# Altium schematic sheet ZZ201P.SchDoc
size A3
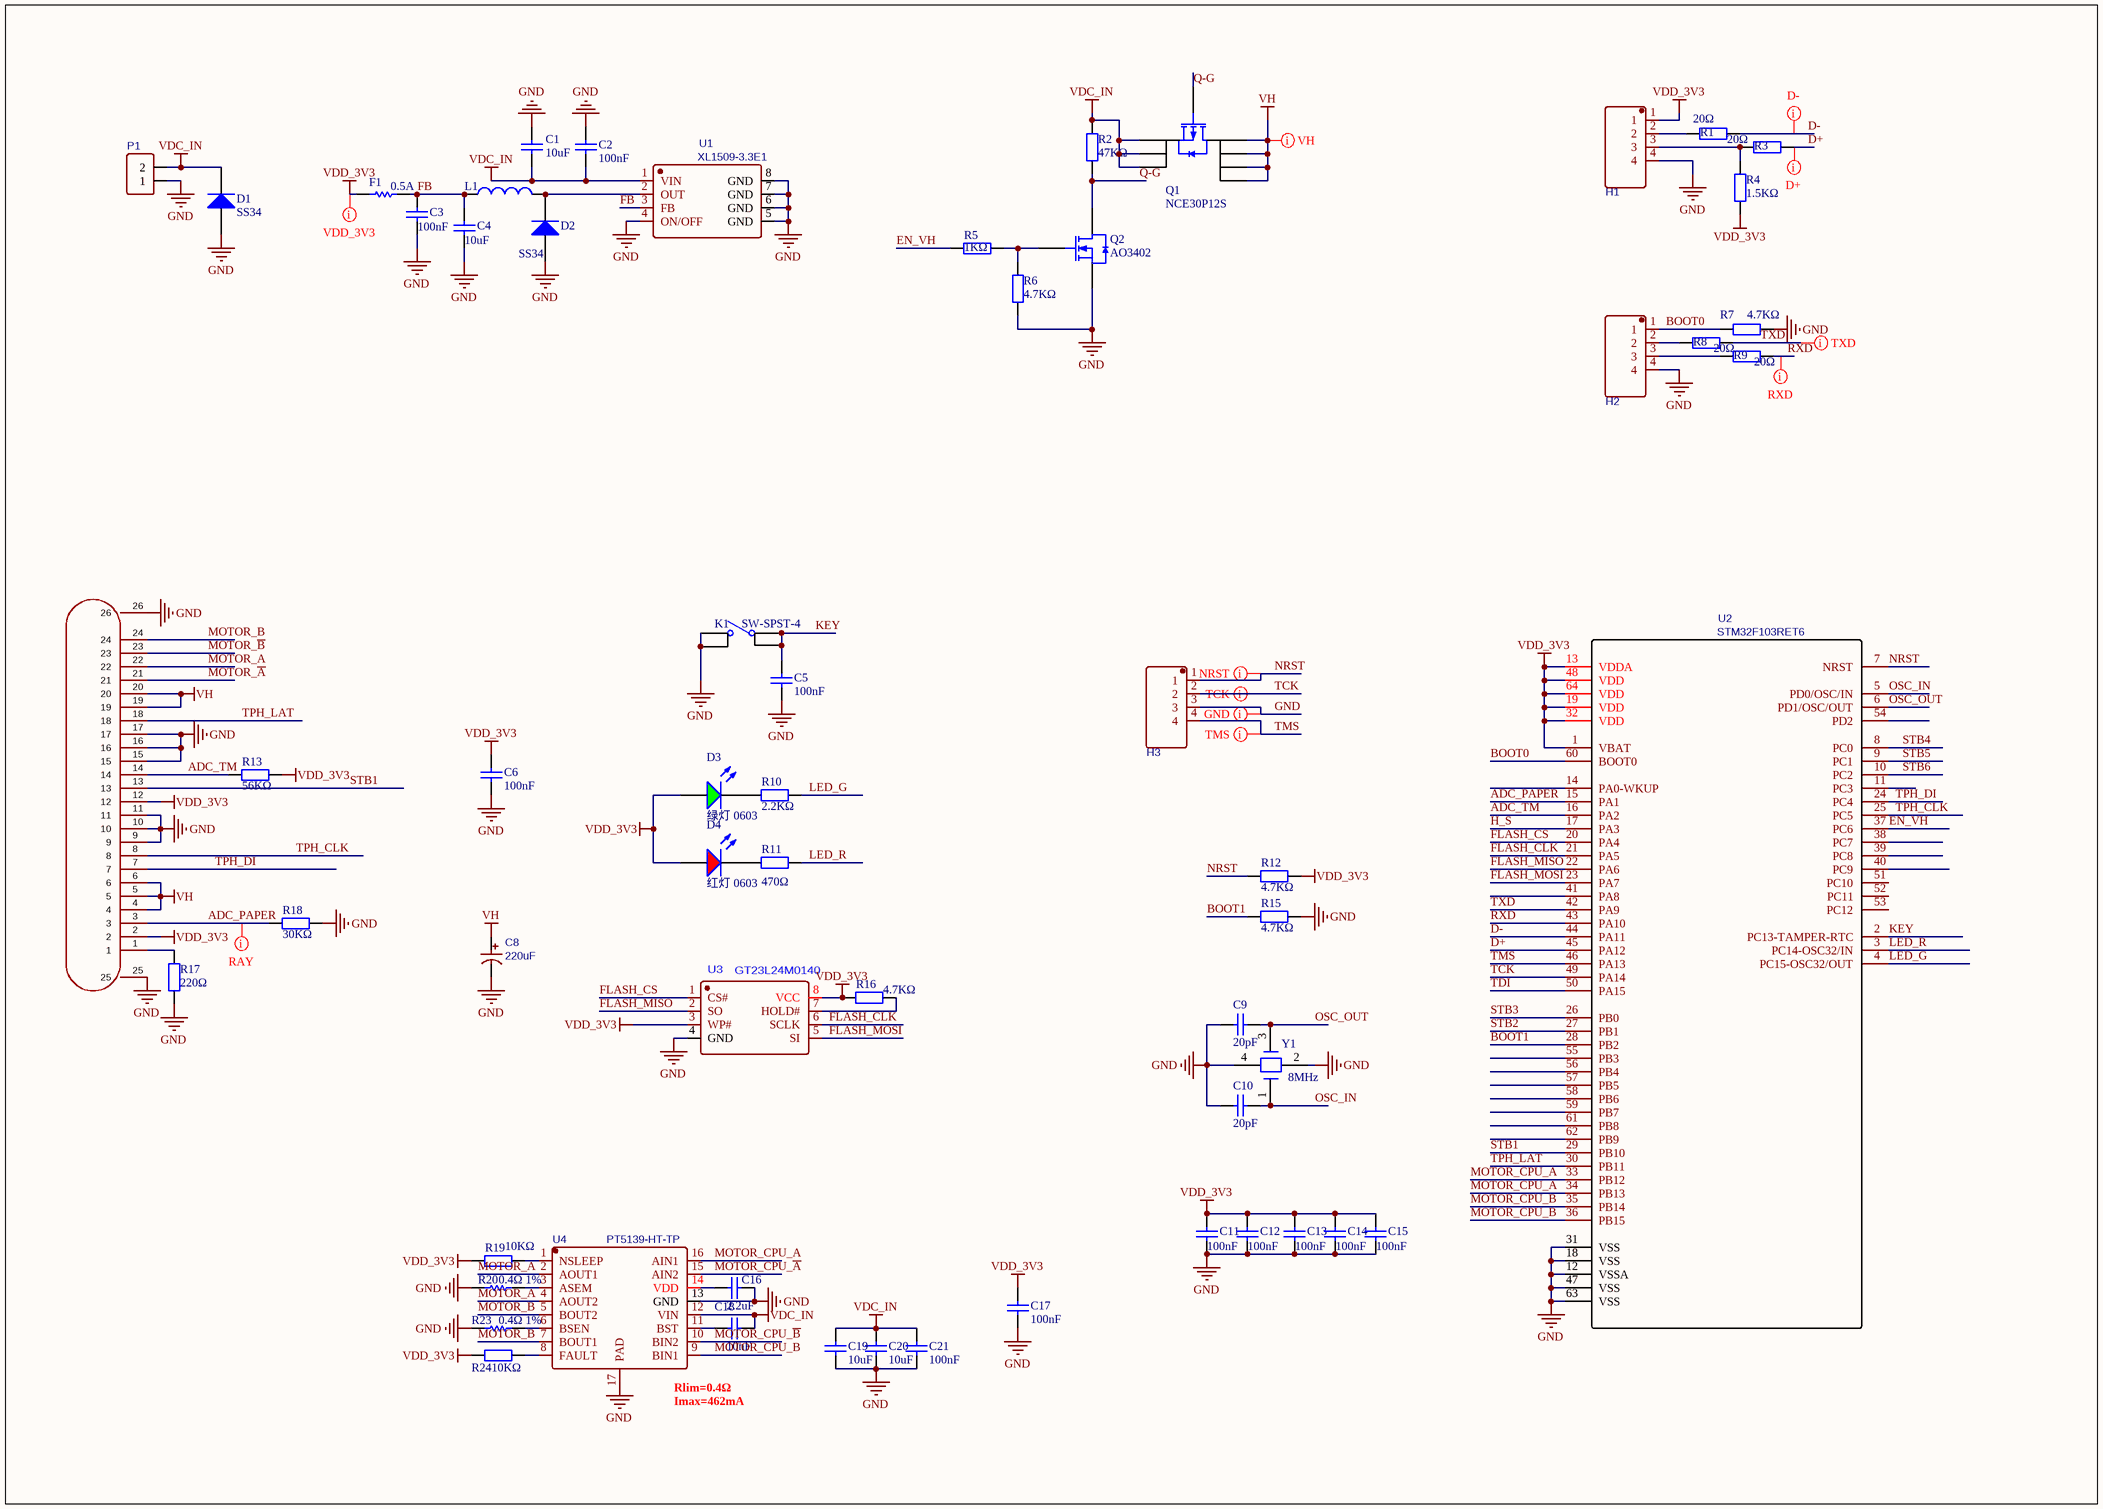
[diagram p0: ZZ201P.SchDoc]

## Parts
C1  10uF  [0603_C]
C2  100nF  [0603_C]
C3  100nF  [0603_C]
C4  10uF  [0603_C]
C5  100nF  [0603_C]
C6  100nF  [0603_C]
C8  220uF  [CASE-B_3528]
C9  20pF  [0603_C]
C10  20pF  [0603_C]
C11  100nF  [0603_C]
C12  100nF  [0603_C]
C13  100nF  [0603_C]
C14  100nF  [0603_C]
C15  100nF  [0603_C]
C16  2.2uF  [0603_C]
C17  100nF  [0603_C]
C18  10nF  [0603_C]
C19  10uF  [0603_C]
C20  10uF  [0603_C]
C21  100nF  [0603_C]
D1  SS34  [SMA_L4.4-W2.8-LS5.4-RD]
D2  SS34  [SMA_L4.4-W2.8-LS5.4-RD]
D3  绿灯 0603  [0603_LED_S1]
D4  红灯 0603  [0603_LED_S1]
F1  0.5A  [0603_R]
FPC?  afc07-s24eca-00  [2P-P2.54-V]  (value not drawn)
H1  77311-462K05LF  [PCBComponent_1 - duplicate]  (value not drawn)
H2  77311-462K05LF  [PCBComponent_1 - duplicate]  (value not drawn)
H3  77311-462K05LF  [5P_1.25]  (value not drawn)
K1  SW-SPST-4  [KEY-SMD_4P-L5.2-W5.2-P3.70-LS6.4]
L1  4040-47uH  [IND-SMD_L4.0-W4.0_FNR40XXS]  (value not drawn)
P1  Header-Female-2.54_1x2  [2P-P2.54-V]  (value not drawn)
Q1  NCE30P12S  [SOIC-8_150mil]
Q2  AO3402  [SOT-23]
R1  20Ω  [0603_R]
R2  47KΩ  [0603_R]
R3  20Ω  [0603_R]
R4  1.5KΩ  [0603_R]
R5  1KΩ  [0603_R]
R6  4.7KΩ  [0603_R]
R7  4.7KΩ  [0603_R]
R8  20Ω  [0603_R]
R9  20Ω  [0603_R]
R10  2.2KΩ  [0603_R]
R11  470Ω  [0603_R]
R12  4.7KΩ  [0603_R]
R13  56KΩ  [0603_R]
R15  4.7KΩ  [0603_R]
R16  4.7KΩ  [0603_R]
R17  220Ω  [0603_C]
R18  30KΩ  [0603_R]
R19  10KΩ  [0603_R]
R20  0.4Ω 1%  [1206_r]
R23  0.4Ω 1%  [1206_R]
R24  10KΩ  [0603_R]
U1  XL1509-3.3E1  [SOP-8_L4.9-W3.9-P1.27-LS6.0-BL]
U2  STM32F103RET6  [LQFP-64_L10.0-W10.0-P0.50-LS12.0-BL]
U3  GT23L24M0140  [SOP-8_L5.3-W5.3-P1.27-LS8.0-BL]
U4  PT5139-HT-TP  [HTSSOP-16_L5.0-W4.4-P0.65-LS6.4-BL-EP]
Y1  8MHz  [XT_3225_4]

## Nets
GND: C1.2 C2.2 C3.2 C4.2 C5.2 C6.1 C8.2 C9.1 C10.1 C11.1 C12.1 C13.1 C14.1 C15.1 C16.2 C17.1 C19.1 C20.1 C21.1 D1.1(A) D2.1(A) FPC?.9 FPC?.10 FPC?.11 FPC?.15 FPC?.16 FPC?.17 FPC?.25 FPC?.26 H1.4 H2.4 H3.3 K1.3 K1.4(NO) P1.1 Q2.2(S) R6.1 R7.2 R15.1 R17.1 R18.2 R20.2 R23.2 U1.4(ON/OFF) U1.5(GND) U1.6(GND) U1.7(GND) U1.8(GND) U2.12(VSSA) U2.18(VSS) U2.31(VSS) U2.47(VSS) U2.63(VSS) U3.4(GND) U4.13(GND) U4.17(PAD) Y1.2 Y1.4
VDC_IN: C1.1 C2.1 C18.2 C19.2 C20.2 C21.2 D1.2(K) P1.2 Q1.1(S) Q1.2(S) Q1.3(S) R2.2 U1.1(VIN) U4.12(VIN)
VDD_3V3: C6.2 C11.2 C12.2 C13.2 C14.2 C15.2 C17.2 D3.A D4.A F1.1 FPC?.2 FPC?.12 H1.1 R4.1 R12.1 R13.2 R16.2 R19.2 R24.2 U2.1(VBAT) U2.13(VDDA) U2.19(VDD) U2.32(VDD) U2.48(VDD) U2.64(VDD) U3.3(WP#) U3.8(VCC)
VH: C8.1 FPC?.4 FPC?.5 FPC?.6 FPC?.19 FPC?.20 Q1.5(D) Q1.6(D) Q1.7(D) Q1.8(D)
ADC_PAPER: FPC?.3 R18.1 U2.15(PA1)
ADC_TM: FPC?.14 R13.1 U2.16(PA2)
BOOT0: H2.1 R7.1 U2.60(BOOT0)
BOOT1: R15.2 U2.28(PB2)
D+: R3.2 U2.45(PA12)
D-: R1.2 U2.44(PA11)
EN_VH: R5.2 U2.37(PC6)
FB: C3.1 C4.1 F1.2 L1.1 U1.3(FB)
FLASH_CLK: U2.21(PA5) U3.6(SCLK)
FLASH_CS: U2.20(PA4) U3.1(CS#)
FLASH_MISO: U2.22(PA6) U3.2(SO)
FLASH_MOSI: U2.23(PA7) U3.5(SI)
H_S: U2.17(PA3)
KEY: C5.1 K1.1(COMMON) K1.2 U2.2(PC13-TAMPER-RTC)
LED_G: R10.2 U2.4(PC15-OSC32/OUT)
LED_R: R11.2 U2.3(PC14-OSC32/IN)
MOTOR_A: FPC?.22 U4.2(AOUT1)
MOTOR_~{A}: FPC?.21 U4.4(AOUT2)
MOTOR_B: FPC?.24 U4.7(BOUT1)
MOTOR_~{B}: FPC?.23 U4.5(BOUT2)
MOTOR_CPU_A: U2.33(PB12) U4.16(AIN1)
MOTOR_CPU_~{A}: U2.34(PB13) U4.15(AIN2)
MOTOR_CPU_B: U2.36(PB15) U4.9(BIN1)
MOTOR_CPU_~{B}: U2.35(PB14) U4.10(BIN2)
NRST: H3.1 R12.2 U2.7(NRST)
OSC_IN: C10.2 U2.5(PD0/OSC/IN) Y1.1(OSC1)
OSC_OUT: C9.2 U2.6(PD1/OSC/OUT) Y1.3(OSC2)
Q-G: Q1.4(G) Q2.3(D) R2.1
RXD: R9.2 U2.43(PA10)
STB1: FPC?.13 U2.29(PB10)
STB2: U2.27(PB1)
STB3: U2.26(PB0)
STB4: U2.8(PC0)
STB5: U2.9(PC1)
STB6: U2.10(PC2)
TCK: H3.2 U2.49(PA14)
TDI: U2.50(PA15)
TMS: H3.4 U2.46(PA13)
TPH_CLK: FPC?.8 U2.25(PC5)
TPH_DI: FPC?.7 U2.24(PC4)
TPH_LAT: FPC?.18 U2.30(PB11)
TXD: R8.2 U2.42(PA9)
NetC16_1: C16.1 U4.14(VDD)
NetC18_1: C18.1 U4.11(BST)
NetD2_2: D2.2(K) L1.2 U1.2(OUT)
NetD3_K: D3.K R10.1
NetD4_K: D4.K R11.1
NetFPC?_1: FPC?.1 R17.2
NetH1_2: H1.2 R1.1
NetH1_3: H1.3 R3.1 R4.2
NetH2_2: H2.2 R8.1
NetH2_3: H2.3 R9.1
NetQ2_1: Q2.1(G) R5.1 R6.2
NetR16_1: R16.1 U3.7(HOLD#)
NetR19_1: R19.1 U4.1(NSLEEP)
NetR20_1: R20.1 U4.3(ASEM)
NetR23_1: R23.1 U4.6(BSEN)
NetR24_1: R24.1 U4.8(FAULT)

Not connected (* = marked no-connect by the designer): U2 11(PC3) 14(PA0-WKUP) 38(PC7) 39(PC8) 40(PC9) 41(PA8) 51(PC10) 52(PC11) 53(PC12) 54(PD2) 55(PB3) 56(PB4) 57(PB5) 58(PB6) 59(PB7) 61(PB8) 62(PB9)

## Layout directives
Column: TestVectorIndex: ADC_PAPER, D+, D-, GND, NRST, RXD, TCK, TMS, TXD, VDD_3V3, VH

## Notes on the sheet
- (near U4) Rlim=0.4Ω
- (near U4) Imax=462mA

## Library data of the parts
C1 C19 C20 = 0805 10uF (106) 10% 25V: 贴片电容; ComponentLink1Description: 供应商链接; ComponentLink1URL: http://www.szlcsc.com/product/details_16532.html; Package: 0805; Supplier: LC; SuppliersPartNumber: C15850
C2-C6 C11-C15 C17 C21 = 0603 100nF (104) 10% 50V: 贴片电容; ComponentLink1Description: 供应商链接; ComponentLink1URL: http://www.szlcsc.com/product/details_15331.html; Package: 0603; Supplier: LC; SuppliersPartNumber: C14663
C8 = 10uF: BOM_Manufacturer: ValuePro; BOM_Manufacturer Part: 10uF 25V RHOS; nameAlias: Capacitance; BOM_Supplier: LCSC; BOM_Supplier Part: C19576; spicePre: C; spiceSymbolName: 10uF 25V RHOS
C9 C10 = 0603 10pF (100) 5% 50V: 贴片电容; ComponentLink1Description: 供应商链接; ComponentLink1URL: http://www.szlcsc.com/product/details_1986.html; Package: 0603; Supplier: LC; SuppliersPartNumber: C1634
C16 = 0805 2.2uF (225) 20% 50V: 贴片电容; ComponentLink1Description: 供应商链接; ComponentLink1URL: http://www.szlcsc.com/product/details_50225.html; Package: 0805; Supplier: LC; SuppliersPartNumber: C49217
C18 = 0603 10nF (103) 10% 50V: 贴片电容; ComponentLink1Description: 供应商链接; ComponentLink1URL: http://www.szlcsc.com/product/details_58143.html; Package: 0603; Supplier: LC; SuppliersPartNumber: C57112
D1 = SMA(DO-214AC) M7: 二极管; 备注: 1N4007 4007 编号C2464 已经停售, 使用新物料编号C95872; ComponentLink1Description: 供应商链接; ComponentLink1URL: http://www.szlcsc.com/product/details_2841.html; Package: SMA(DO-214AC); Supplier: LC; SuppliersPartNumber: C95872
D2 = SOD-323 1N4148WS T4: 二极管; ComponentLink1Description: 供应商链接; ComponentLink1URL: http://www.szlcsc.com/product/details_2485.html; Package: SOD-323; Supplier: LC; SuppliersPartNumber: C2128
D3 = 0603 绿灯: 发光二极管; ComponentLink1Description: 供应商链接; ComponentLink1URL: http://www.szlcsc.com/product/details_73152.html; Package: 0603; Supplier: LC; SuppliersPartNumber: C72043
D4 = 0603 红灯: 发光二极管; ComponentLink1Description: 供应商链接; ComponentLink1URL: http://www.szlcsc.com/product/details_2659.html; Package: 0603; Supplier: LC; SuppliersPartNumber: C2286
F1 = Res1: Resistor; Published: 8-Jun-2000; LatestRevisionDate: 17-Jul-2002; LatestRevisionNote: Re-released for DXP Platform.; PackageReference: AXIAL-0.3; Publisher: Altium Limited
FPC? = afc07-s24eca-00: 锁定特性:抽屉式;触点类型:上接;触点数量:24P;间距:0.5mm;安装类型:卧贴;; Manufacturer: JS(钜硕电子); AddInBom: yes; ModelId: 6bbc45c14a884fb5877d6cdbe51e6fe5; ModelName: FPC-SMD_AFC07-S24ECA-00; ModelTransform: 692.912,204.724,0,0,0,0,0.002,-58.424,0; Locking Feature: 抽屉式; Number of Contacts: 24P; Pitch: 0.5mm; FFC, FCB Thickness: 0.3mm; Symbol: AFC07-S24ECA-00; LCSC Part Name: 间距:0.5mm P数:24P 抽屉式 上接; SupplierPart: C262643; ManufacturerPart: AFC07-S24ECA-00; Supplier Footprint: SMD,P=0.5mm,卧贴; JLCPCB Part Class: Extended Part; Datasheet: https://atta.szlcsc.com/upload/public/pdf/source/20190726/C11082_A2E7B12387019CE4314BB5199EE0FDF4.pdf; Supplier: LCSC; ConvertToPcb: yes; FootprintName: FPC-SMD_AFC07-S24ECA-00; Contact Type: 上接; Mounting Type: 卧贴; Height Above Board: 2mm
H1-H3 = 77311-462K05LF: BOM_Manufacturer: Amphenol ICC; Contributor: LCSC; BOM_Supplier: LCSC; BOM_Supplier Part: C180219; BOM_Manufacturer Part: 77311-462K05LF; spicePre: H; spiceSymbolName: 77311-462K05LF
L1 = Inductor: Code_IEC: 1005; Value: 48uH; Published: 8-Jun-2000; LatestRevisionDate: 29-May-2009; LatestRevisionNote: IPC-7351 Footprint Added.; PackageReference: 0402-A; Publisher: Altium Limited; PackageDescription: Chip Inductor; Code_JEITA: 0402
P1 = Header-Female-2.54_1x2: BOM_Manufacturer: BOOMELE; BOM_Manufacturer Part: 2.54-1*2PFemale; BOM_Supplier: LCSC; image: //image.lceda.cn/szlcsc/C49661.jpg; BOM_Supplier Part: C49661; spicePre: P; spiceSymbolName: Header-Female-2.54_1x2
Q1 = AO4407A: MOS(场效应管); ComponentLink1Description: 供应商链接; ComponentLink1URL: http://www.szlcsc.com/product/details_16754.html; Package: SOIC-8_150mil; Supplier: LC; SuppliersPartNumber: C16072
Q2 = AO3400A N道沟 X0YV1T SOT-23: MOS(场效应管); ComponentLink1Description: 供应商链接; ComponentLink1URL: http://www.szlcsc.com/product/details_21629.html; Package: SOT-23; Supplier: LC; SuppliersPartNumber: C20917
R1 R3 R4 R8 R9 = 0603 100Ω (1000) 1%: 贴片电阻; ComponentLink1Description: 供应商链接; ComponentLink1URL: http://www.szlcsc.com/product/details_23502.html; Package: 0603; Supplier: LC; SuppliersPartNumber: C22775
R2 = 0603 47KΩ (4702) 1%: 贴片电阻; ComponentLink1Description: 供应商链接; ComponentLink1URL: http://www.szlcsc.com/product/details_26562.html; Package: 0603; Supplier: LC; SuppliersPartNumber: C25819
R5 = 0603 470Ω (4700) 1%: 贴片电阻; ComponentLink1Description: 供应商链接; ComponentLink1URL: http://www.szlcsc.com/product/details_23906.html; Package: 0603; Supplier: LC; SuppliersPartNumber: C23179
R6 R7 R12 R15 R16 = 0603 4.7KΩ (4701) 1%: 贴片电阻; ComponentLink1Description: 供应商链接; ComponentLink1URL: http://www.szlcsc.com/product/details_23889.html; Package: 0603; Supplier: LC; SuppliersPartNumber: C23162
R10 R11 = 0603 2KΩ (2001) 1%: 贴片电阻; ComponentLink1Description: 供应商链接; ComponentLink1URL: http://www.szlcsc.com/product/details_23702.html; Package: 0603; Supplier: LC; SuppliersPartNumber: C22975
R13 R19 R24 = 0603 10KΩ (1002) 1%: 贴片电阻; ComponentLink1Description: 供应商链接; ComponentLink1URL: http://www.szlcsc.com/product/details_26547.html; Package: 0603; Supplier: LC; SuppliersPartNumber: C25804
R17 = 0603 200Ω (2000) 1%: 贴片电阻; ComponentLink1Description: 供应商链接; ComponentLink1URL: http://www.szlcsc.com/product/details_8708.html; Package: 0603; Supplier: LC; SuppliersPartNumber: C8218
R18 = 0603 30KΩ (3002) 1%: 贴片电阻; ComponentLink1Description: 供应商链接; ComponentLink1URL: http://www.szlcsc.com/product/details_23711.html; Package: 0603; Supplier: LC; SuppliersPartNumber: C22984
R20 R23 = Res: Resistor; Value: 1K; Published: 8-Jun-2000; LatestRevisionDate: 17-Jul-2002; LatestRevisionNote: Re-released for DXP Platform.; PackageReference: 0603; Publisher: Altium Limited; PackageDescription: Axial Device, Thru-Hole; 2 Leads; 0.3 in Pin Spacing
U1 = XL1509-3.3E1: BOM_Manufacturer: XLSEMI; SMT Type: Extend; BOM_Supplier: LCSC; BOM_Manufacturer Part: XL1509-3.3E1; image: //image.lceda.cn/szlcsc/C74193.jpg; BOM_Supplier Part: C74193; BOM_LCSC Assembly: Yes; spicePre: U; spiceSymbolName: XL1509-3.3E1
U2 = STM32F103RET6: BOM_Manufacturer: STMicroelectronics; SMT Type: Basic; BOM_Supplier: LCSC; BOM_Manufacturer Part: STM32F103RET6; image: //image.lceda.cn/szlcsc/C8322.jpg; BOM_Supplier Part: C8322; BOM_JLCPCB SMD: Yes; spicePre: U; spiceSymbolName: STM32F103RET6
U3 = GD25Q64CSIG
U4 = PT5139-HT-TP: BOM_Manufacturer: Princeton Tech; Contributor: LCSC; BOM_Supplier: LCSC; BOM_Supplier Part: C336601; BOM_Manufacturer Part: PT5139-HT-TP; spicePre: U; spiceSymbolName: PT5139-HT-TP
Y1 = XTAL_4: Crystal Oscillator